# EAGLE schematic main_rev3 (EAGLE 7.1.0)
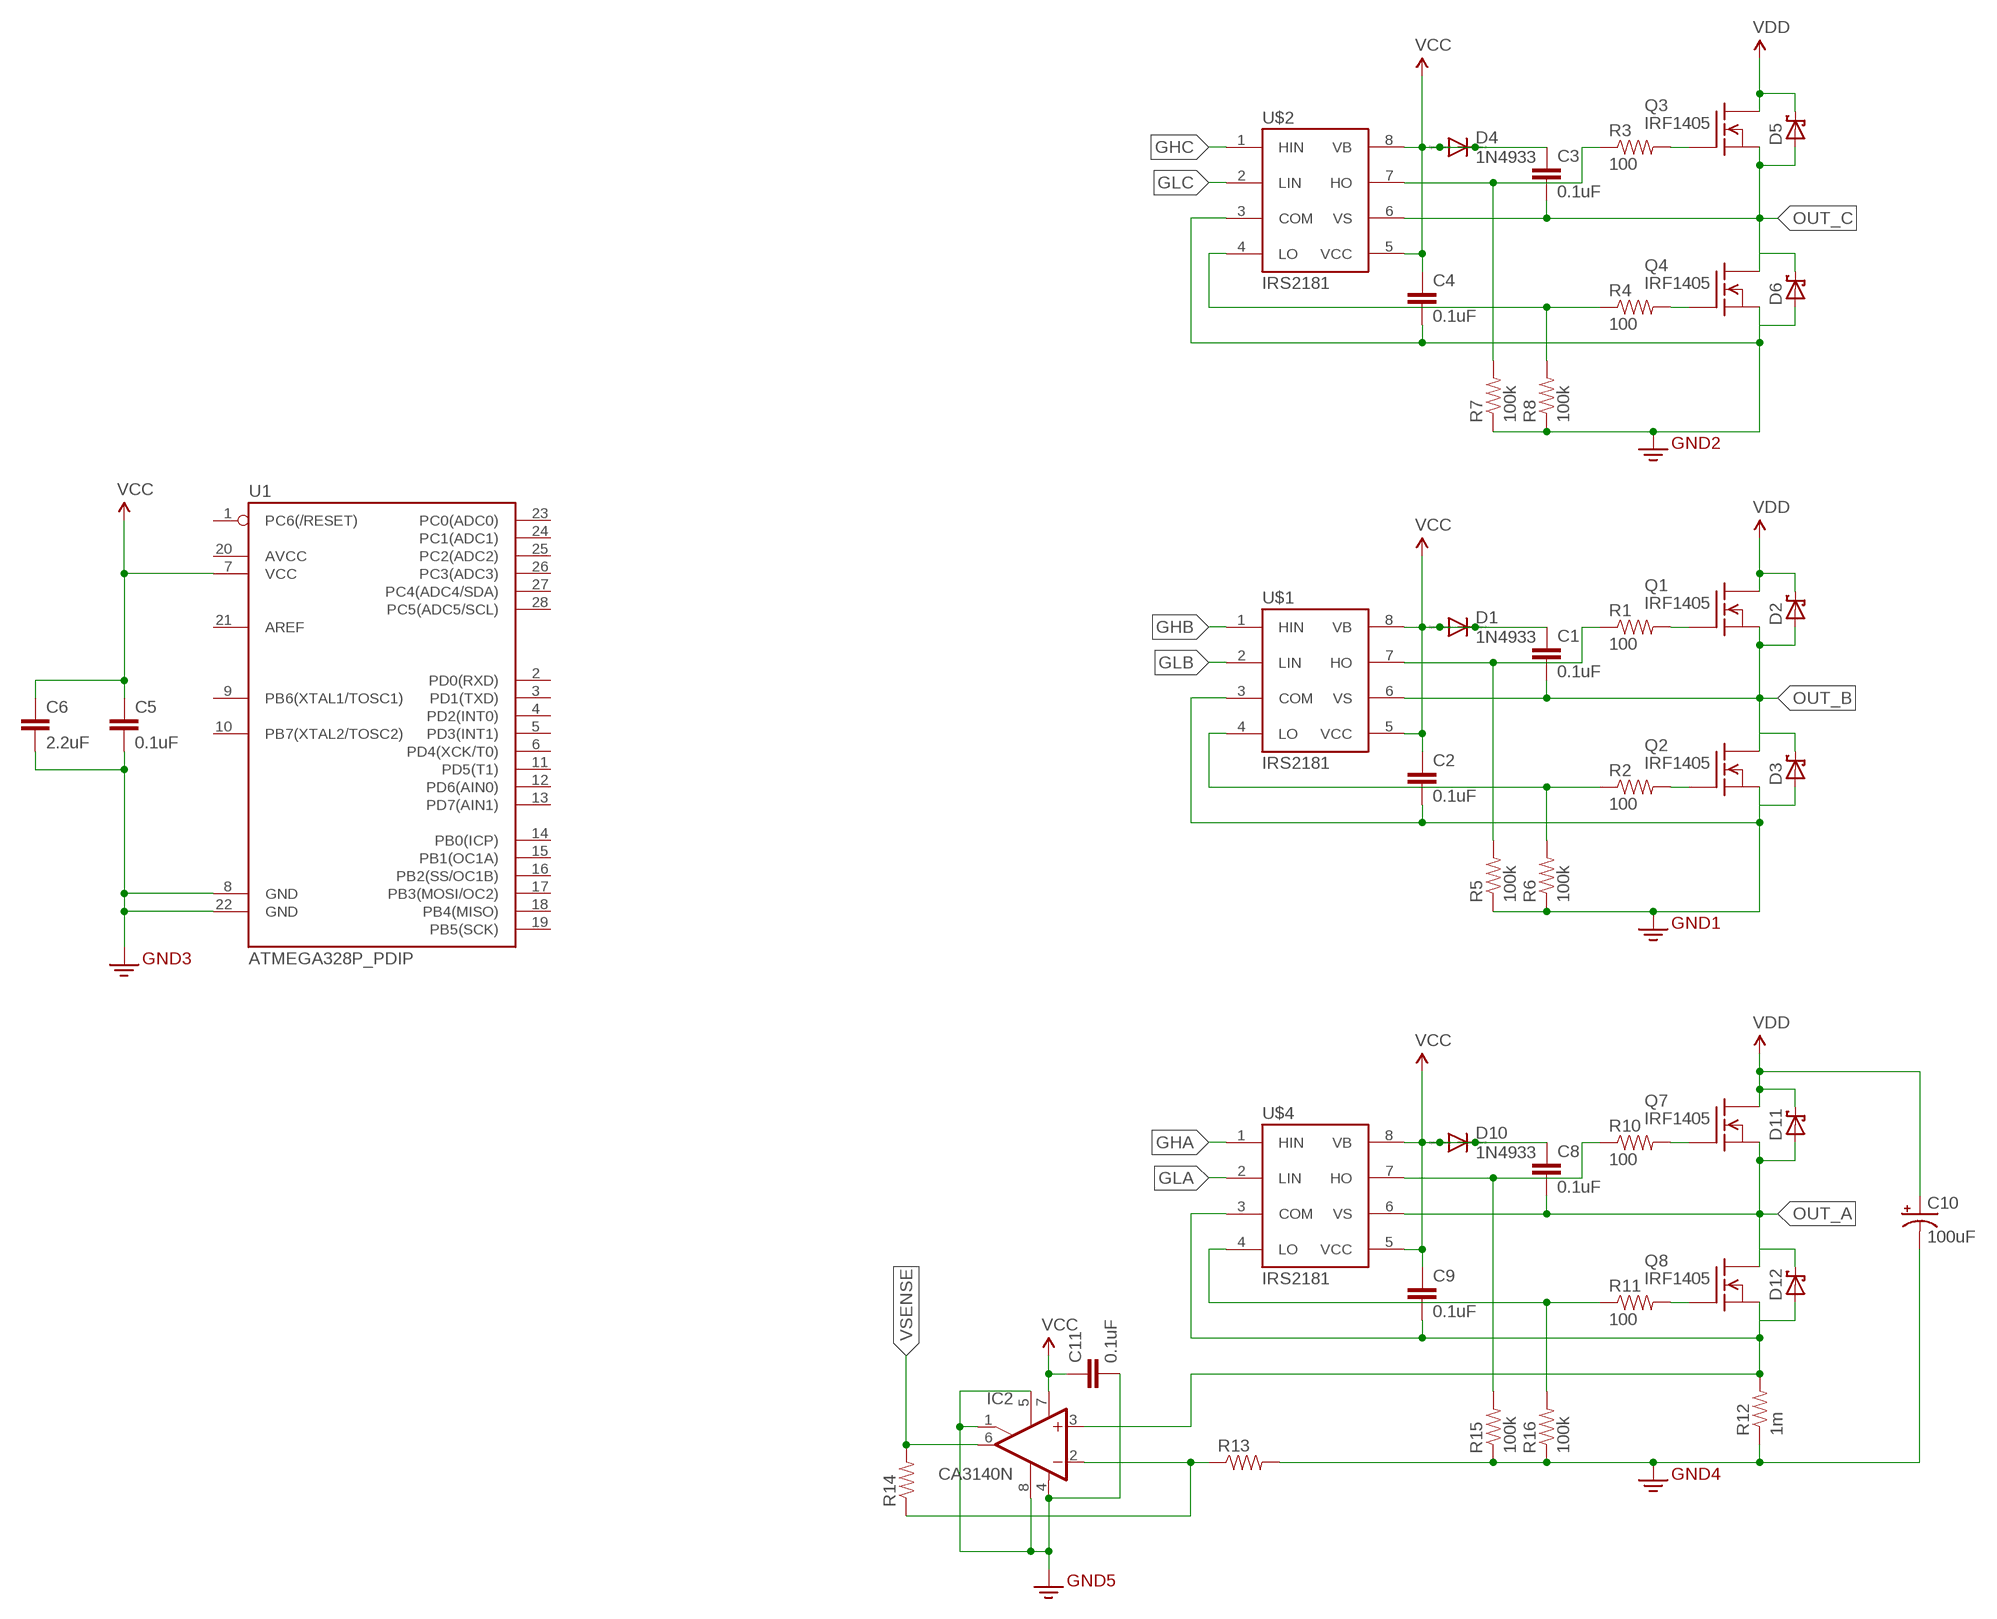
[diagram p0: schematic, sheet 1]

## Parts
C1  0.1uF  0.1UF-25V(+80/-20%)(0603)  [0603-CAP]
C2  0.1uF  0.1UF-25V(+80/-20%)(0603)  [0603-CAP]
C3  0.1uF  0.1UF-25V(+80/-20%)(0603)  [0603-CAP]
C4  0.1uF  0.1UF-25V(+80/-20%)(0603)  [0603-CAP]
C5  0.1uF  0.1UF-25V(+80/-20%)(0603)  [0603-CAP]
C6  2.2uF  2.2UF-25V-+80/-20(0805)  [0805]
C8  0.1uF  0.1UF-25V(+80/-20%)(0603)  [0603-CAP]
C9  0.1uF  0.1UF-25V(+80/-20%)(0603)  [0603-CAP]
C10  100uF  100UF-63V-20%(ELECT)  [PANASONIC_H13]
C11  0.1uF  0.1UF-25V(+80/-20%)(0603)  [0603-CAP]
D1  1N4933  [DO41-10]
D2  SCHOTTKY-DIODEDO41  [DO41-10]
D3  SCHOTTKY-DIODEDO41  [DO41-10]
D4  1N4933  [DO41-10]
D5  SCHOTTKY-DIODEDO41  [DO41-10]
D6  SCHOTTKY-DIODEDO41  [DO41-10]
D10  1N4933  [DO41-10]
D11  SCHOTTKY-DIODEDO41  [DO41-10]
D12  SCHOTTKY-DIODEDO41  [DO41-10]
IC2  CA3140N  [DIL08]
Q1  IRF1405  IRF540  [TO220]
Q2  IRF1405  IRF540  [TO220]
Q3  IRF1405  IRF540  [TO220]
Q4  IRF1405  IRF540  [TO220]
Q7  IRF1405  IRF540  [TO220]
Q8  IRF1405  IRF540  [TO220]
R1  100  RESISTORAXIAL-0.3  [AXIAL-0.3]
R2  100  RESISTORAXIAL-0.3  [AXIAL-0.3]
R3  100  RESISTORAXIAL-0.3  [AXIAL-0.3]
R4  100  RESISTORAXIAL-0.3  [AXIAL-0.3]
R5  100k  RESISTORAXIAL-0.3  [AXIAL-0.3]
R6  100k  RESISTORAXIAL-0.3  [AXIAL-0.3]
R7  100k  RESISTORAXIAL-0.3  [AXIAL-0.3]
R8  100k  RESISTORAXIAL-0.3  [AXIAL-0.3]
R10  100  RESISTORAXIAL-0.3  [AXIAL-0.3]
R11  100  RESISTORAXIAL-0.3  [AXIAL-0.3]
R12  1m  RESISTORPTH-2W  [AXIAL-0.8]
R13  RESISTORAXIAL-0.3  [AXIAL-0.3]
R14  RESISTORAXIAL-0.3  [AXIAL-0.3]
R15  100k  RESISTORAXIAL-0.3  [AXIAL-0.3]
R16  100k  RESISTORAXIAL-0.3  [AXIAL-0.3]
U1  ATMEGA328P_PDIP  [DIL28-3]
U$1  IRS2181  [DIP08]
U$2  IRS2181  [DIP08]
U$4  IRS2181  [DIP08]

## Nets
3.3V: C2.2 C4.2 C5.2 C6.2 C10.- C11.2 IC2.1(ON/CMP) IC2.4(V-) IC2.5(ON) IC2.8(CMP) Q2.3(S) Q4.3(S) R5.P$1 R6.P$1 R7.P$1 R8.P$1 R12.P$1 R13.P$2 R15.P$1 R16.P$1 U1.8(GND) U1.22(GND) U$1.3(COM) U$2.3(COM) ; supply symbol labelled GND2
GHA: U$4.1(HIN)
GHB: U$1.1(HIN)
GHC: U$2.1(HIN)
GLA: U$4.2(LIN)
GLB: U$1.2(LIN)
GLC: U$2.2(LIN)
N$1: R1.P$1 R5.P$2 U$1.7(HO)
N$2: Q1.1(G) R1.P$2
N$3: R2.P$1 R6.P$2 U$1.4(LO)
N$4: Q2.1(G) R2.P$2
N$5: R3.P$1 R7.P$2 U$2.7(HO)
N$6: Q3.1(G) R3.P$2
N$7: R4.P$1 R8.P$2 U$2.4(LO)
N$8: Q4.1(G) R4.P$2
N$15: R10.P$1 R15.P$2 U$4.7(HO)
N$17: Q7.1(G) R10.P$2
N$18: R11.P$1 R16.P$2 U$4.4(LO)
N$19: Q8.1(G) R11.P$2
N$20: C9.2 IC2.3(+IN) Q8.3(S) R12.P$2 U$4.3(COM)
N$21: IC2.2(-IN) R13.P$1 R14.P$1
OUT_A: C8.2 D11.A Q7.3(S) Q8.2(D) U$4.6(VS)
OUT_A1: D3.A
OUT_A2: D6.A
OUT_A6: D12.A
OUT_B: C1.2 D2.A Q1.3(S) Q2.2(D) U$1.6(VS)
OUT_C: C3.2 D5.A Q3.3(S) Q4.2(D) U$2.6(VS)
VCC: C1.1 C2.1 C3.1 C4.1 C5.1 C6.1 C8.1 C9.1 C11.1 D1.A D1.C D4.A D4.C D10.A D10.C IC2.7(V+) U1.7(VCC) U$1.5(VCC) U$1.8(VB) U$2.5(VCC) U$2.8(VB) U$4.5(VCC) U$4.8(VB)
VDD: C10.+ D2.C D5.C D11.C Q1.2(D) Q3.2(D) Q7.2(D)
VDD1: D3.C
VDD2: D6.C
VDD6: D12.C
VSENSE: IC2.6(OUT) R14.P$2
Unconnected: U1.1(PC6(/RESET)) U1.2(PD0(RXD)) U1.3(PD1(TXD)) U1.4(PD2(INT0)) U1.5(PD3(INT1)) U1.6(PD4(XCK/T0)) U1.9(PB6(XTAL1/TOSC1)) U1.10(PB7(XTAL2/TOSC2)) U1.11(PD5(T1)) U1.12(PD6(AIN0)) U1.13(PD7(AIN1)) U1.14(PB0(ICP)) U1.15(PB1(OC1A)) U1.16(PB2(SS/OC1B)) U1.17(PB3(MOSI/OC2)) U1.18(PB4(MISO)) U1.19(PB5(SCK)) U1.20(AVCC) U1.21(AREF) U1.23(PC0(ADC0)) U1.24(PC1(ADC1)) U1.25(PC2(ADC2)) U1.26(PC3(ADC3)) U1.27(PC4(ADC4/SDA)) U1.28(PC5(ADC5/SCL))

## Library data of the parts
C1-C5 C8 C9 C11 = SparkFun-Capacitors:0.1UF-25V(+80/-20%)(0603): CAP-00810 Ceramic Standard decoupling cap; PROD_ID: CAP-00810
C6 = SparkFun-Capacitors:2.2UF-25V-+80/-20(0805): CAP-11624; PROD_ID: CAP-11624
C10 = SparkFun-Capacitors:100UF-63V-20%(ELECT): CAP-08362 100uF electrolytic SMT 63V 20%; PROD_ID: CAP-08362
D1 D4 D10 = diode:1N4933: DIODE fast recovery rectifier, 1A
D2 D3 D5 D6 D11 D12 = adafruit:SCHOTTKY-DIODE: Schottky Diode
IC2 = linear:CA3140: OP AMP
Q1-Q4 Q7 Q8 = transistor-fet:IRF540: N-Channel Enhancement MOSFET (HEXFET); 100V; 28A; 0,077Ohm
R1-R8 R10 R11 R13-R16 = SparkFun-Resistors:RESISTOR: Resistor Basic schematic elements and footprints for 0603, 1206, and PTH resistors.
R12 = SparkFun-Passives:RESISTOR: Resistor Basic schematic elements and footprints for 0603, 1206, and PTH resistors.
U1 = SparkFun-DigitalIC:ATMEGA328P_PDIP: uC used in the Arduino 32kb flash, 1k EEPROM, 2k SRAM This is the through-hole version of this chip.
U$1 U$2 U$4 = Jamie:IRS2181